# EAGLE schematic igep-lcd (EAGLE 6.2)
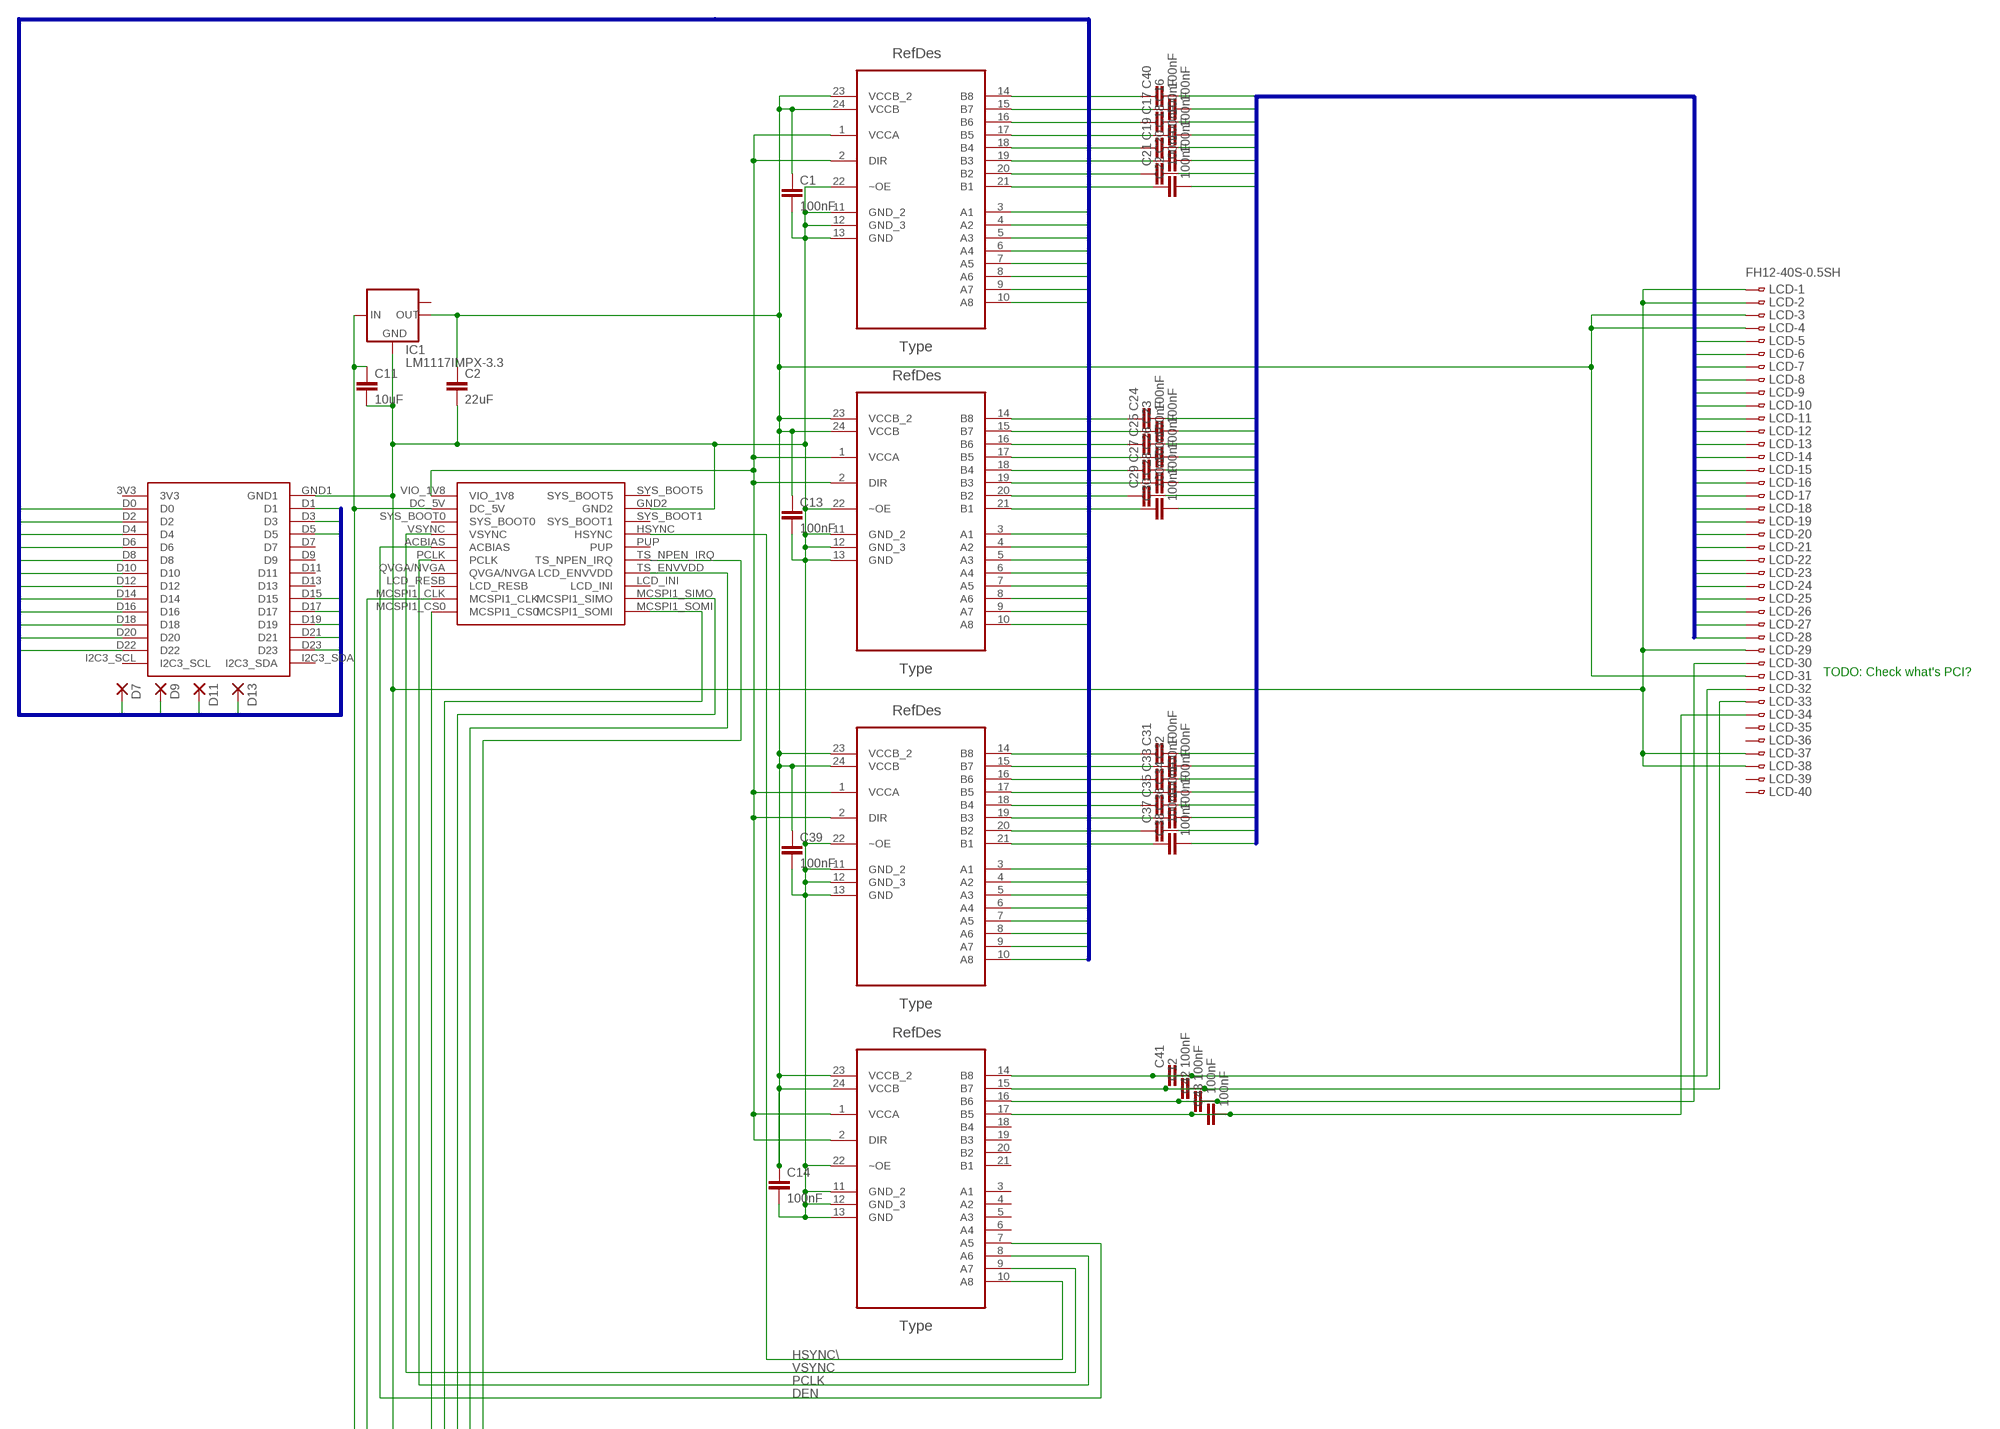
[diagram p0: schematic, sheet 1, part 1 of 2]
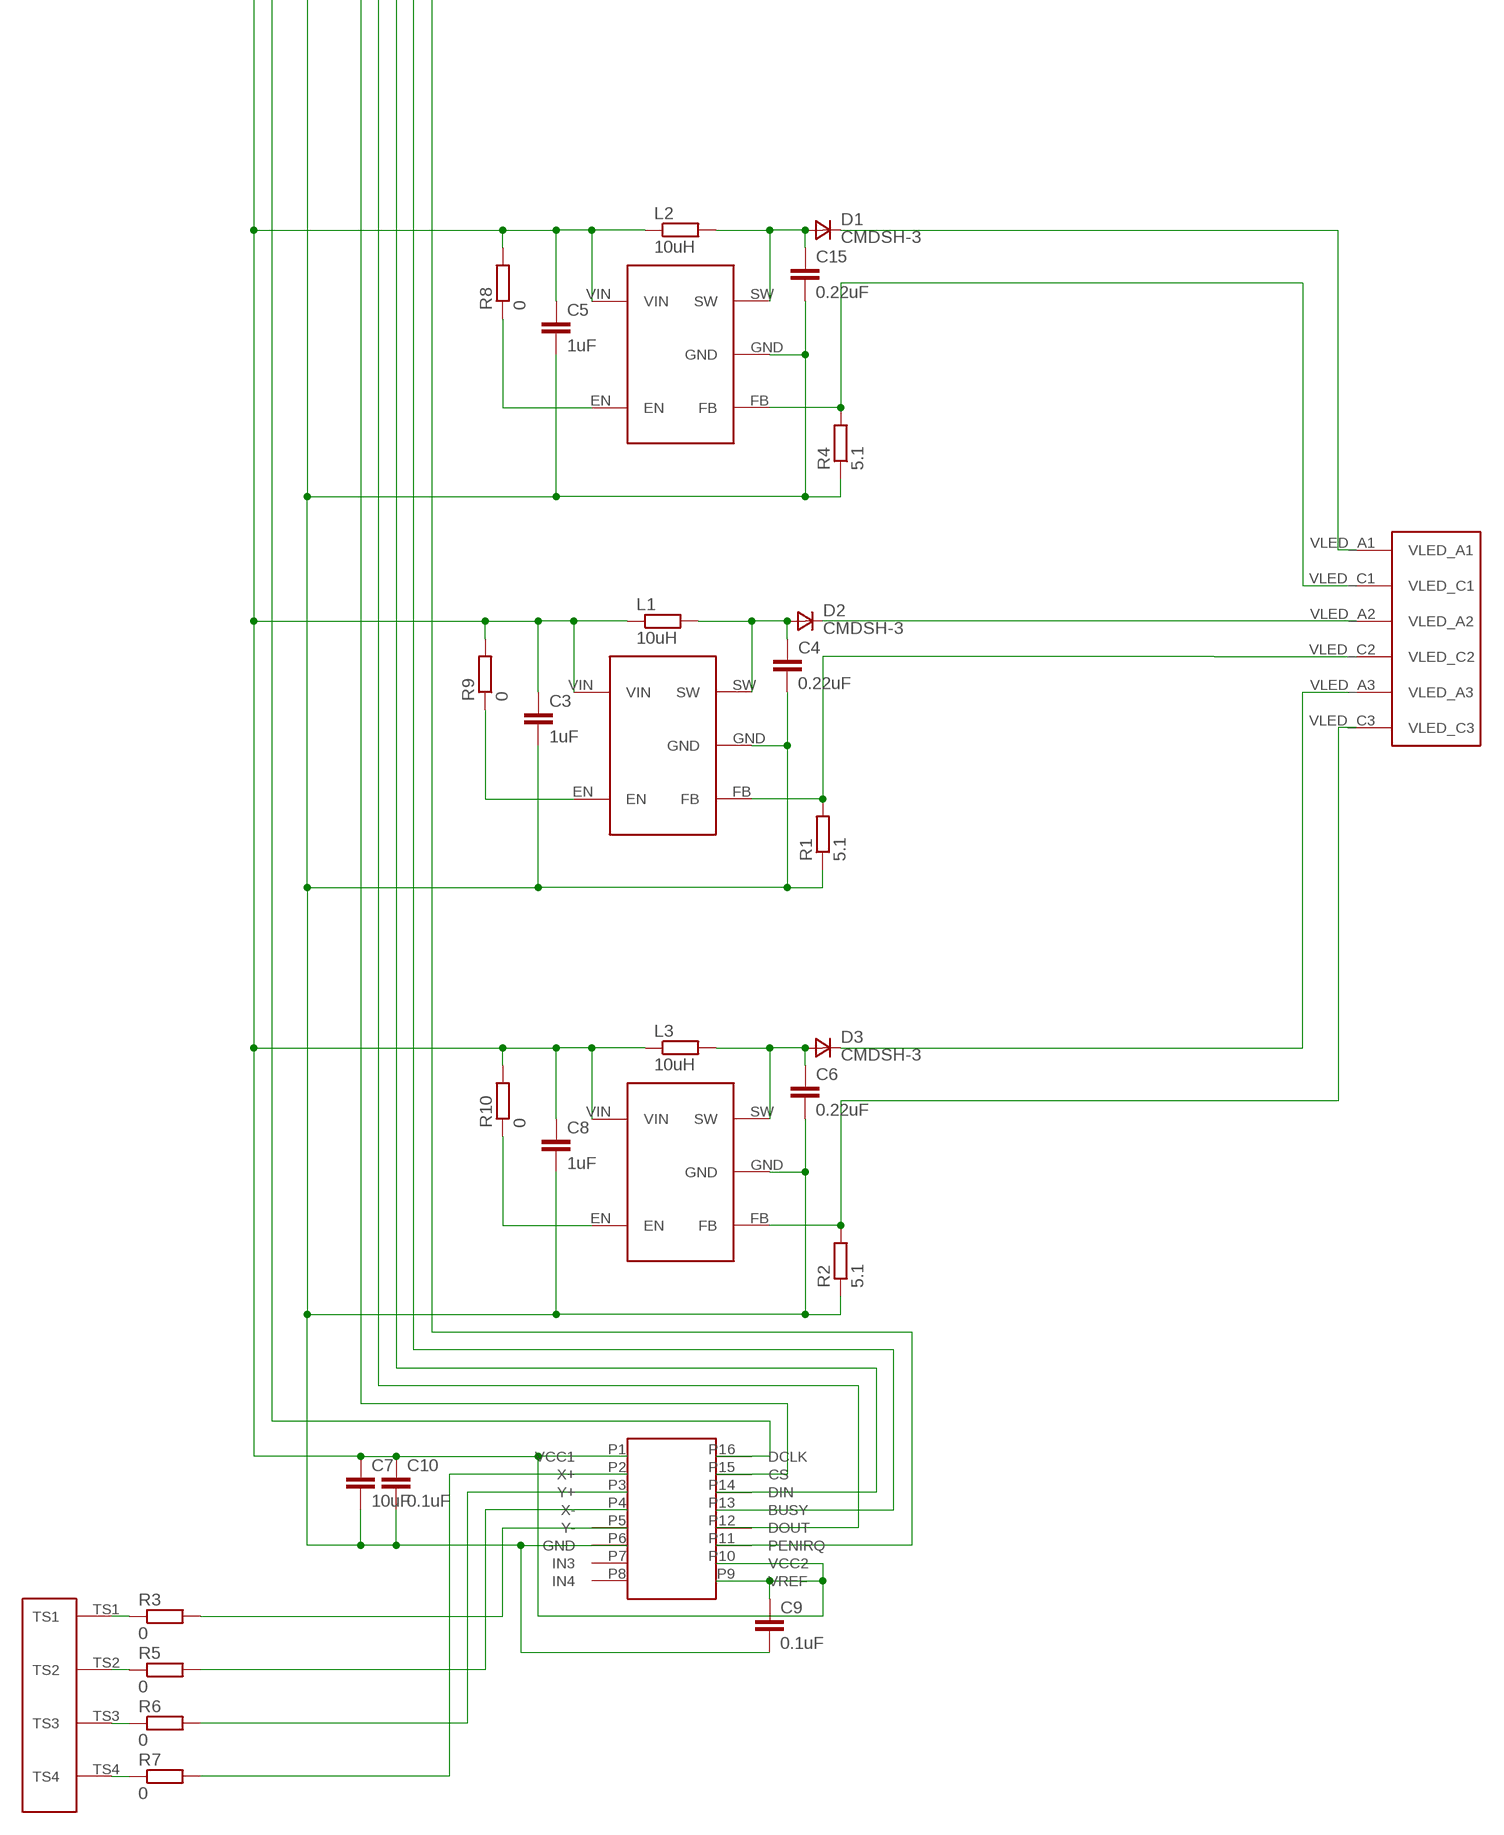
[diagram p1: schematic, sheet 1, part 2 of 2]

## Parts
C1  100nF  C-EUC1206  [C1206]
C2  22uF  C-EUC1206  [C1206]
C3  1uF  C-EUC1206  [C1206]
C4  0.22uF  C-EUC1206  [C1206]
C5  1uF  C-EUC1206  [C1206]
C6  0.22uF  C-EUC1206  [C1206]
C7  10uF  C-EUC1206  [C1206]
C8  1uF  C-EUC1206  [C1206]
C9  0.1uF  C-EUC1206  [C1206]
C10  0.1uF  C-EUC1206  [C1206]
C11  10uF  C-EUC1206  [C1206]
C12  100nF  C-EUC1206  [C1206]
C13  100nF  C-EUC1206  [C1206]
C14  100nF  C-EUC1206  [C1206]
C15  0.22uF  C-EUC1206  [C1206]
C16  100nF  C-EUC1206  [C1206]
C17  100nF  C-EUC1206  [C1206]
C18  100nF  C-EUC1206  [C1206]
C19  100nF  C-EUC1206  [C1206]
C20  100nF  C-EUC1206  [C1206]
C21  100nF  C-EUC1206  [C1206]
C22  100nF  C-EUC1206  [C1206]
C23  100nF  C-EUC1206  [C1206]
C24  100nF  C-EUC1206  [C1206]
C25  100nF  C-EUC1206  [C1206]
C26  100nF  C-EUC1206  [C1206]
C27  100nF  C-EUC1206  [C1206]
C28  100nF  C-EUC1206  [C1206]
C29  100nF  C-EUC1206  [C1206]
C30  100nF  C-EUC1206  [C1206]
C31  100nF  C-EUC1206  [C1206]
C32  100nF  C-EUC1206  [C1206]
C33  100nF  C-EUC1206  [C1206]
C34  100nF  C-EUC1206  [C1206]
C35  100nF  C-EUC1206  [C1206]
C36  100nF  C-EUC1206  [C1206]
C37  100nF  C-EUC1206  [C1206]
C38  100nF  C-EUC1206  [C1206]
C39  100nF  C-EUC1206  [C1206]
C40  100nF  C-EUC1206  [C1206]
C41  100nF  C-EUC1206  [C1206]
C42  100nF  C-EUC1206  [C1206]
C43  100nF  C-EUC1206  [C1206]
D1  CMDSH-3  DSOD323  [SOD323]
D2  CMDSH-3  DSOD323  [SOD323]
D3  CMDSH-3  DSOD323  [SOD323]
D7  1,6/0,8  [1,6/0,8]
D9  1,6/0,8  [1,6/0,8]
D11  1,6/0,8  [1,6/0,8]
D13  1,6/0,8  [1,6/0,8]
IC1  LM1117IMPX-3.3  [SOT223]
L1  10uH  R-EU_R1210  [R1210]
L2  10uH  R-EU_R1210  [R1210]
L3  10uH  R-EU_R1210  [R1210]
LCD  FH12-40S-0.5SH  [FH12-40S-0.5SH]
R1  5.1  R-EU_R1206  [R1206]
R2  5.1  R-EU_R1206  [R1206]
R3  0  R-EU_R1206  [R1206]
R4  5.1  R-EU_R1206  [R1206]
R5  0  R-EU_R1206  [R1206]
R6  0  R-EU_R1206  [R1206]
R7  0  R-EU_R1206  [R1206]
R8  0  R-EU_R1206  [R1206]
R9  0  R-EU_R1206  [R1206]
R10  0  R-EU_R1206  [R1206]
U1  SN74LVC8T245PW  [SOP65P640X120-24N]
U2  SN74LVC8T245PW  [SOP65P640X120-24N]
U3  SN74LVC8T245PW  [SOP65P640X120-24N]
U4  SN74LVC8T245PW  [SOP65P640X120-24N]
U$1  IGEP_LCD  [IGEP_LCD]
U$2  MIC2287  [MIC2287]
U$3  MIC2287  [MIC2287]
U$4  MIC2287  [MIC2287]
U$5  LCD_BL  [LCD_BL]
U$6  ADS7843  [ADS7843]
U$7  TS_CON  [TS_CON]

## Nets
DEN: U4.7(A5) U$1.ACBIAS
HSYNC\: U4.10(A8) U$1.HSYNC
IGEP_LCD_DATA0: U1.3(A1) U$1.D0
IGEP_LCD_DATA1: U1.4(A2) U$1.D1
IGEP_LCD_DATA2: U1.5(A3) U$1.D2
IGEP_LCD_DATA3: U1.6(A4) U$1.D3
IGEP_LCD_DATA4: U1.7(A5) U$1.D4
IGEP_LCD_DATA5: U1.8(A6) U$1.D5
IGEP_LCD_DATA6: U1.9(A7) U$1.D6
IGEP_LCD_DATA7: D7.1(P) U1.10(A8)
IGEP_LCD_DATA8: U2.3(A1) U$1.D8
IGEP_LCD_DATA9: D9.1(P) U2.4(A2)
IGEP_LCD_DATA10: U2.5(A3) U$1.D10
IGEP_LCD_DATA11: D11.1(P) U2.6(A4)
IGEP_LCD_DATA12: U2.7(A5) U$1.D12
IGEP_LCD_DATA13: D13.1(P) U2.8(A6)
IGEP_LCD_DATA14: U2.9(A7) U$1.D14
IGEP_LCD_DATA15: U2.10(A8) U$1.D15
IGEP_LCD_DATA16: U3.3(A1) U$1.D16
IGEP_LCD_DATA17: U3.4(A2) U$1.D17
IGEP_LCD_DATA18: U3.5(A3) U$1.D18
IGEP_LCD_DATA19: U3.6(A4) U$1.D19
IGEP_LCD_DATA20: U3.7(A5) U$1.D20
IGEP_LCD_DATA21: U3.8(A6) U$1.D21
IGEP_LCD_DATA22: U3.9(A7) U$1.D22
IGEP_LCD_DATA23: U3.10(A8) U$1.D23
LCD_DATA0: C22.2 LCD.21
LCD_DATA1: C21.2 LCD.22
LCD_DATA2: C20.2 LCD.23
LCD_DATA3: C19.2 LCD.24
LCD_DATA4: C18.2 LCD.25
LCD_DATA5: C17.2 LCD.26
LCD_DATA6: C16.2 LCD.27
LCD_DATA7: C40.2 LCD.28
LCD_DATA8: C30.2 LCD.13
LCD_DATA9: C29.2 LCD.14
LCD_DATA10: C28.2 LCD.15
LCD_DATA11: C27.2 LCD.16
LCD_DATA12: C26.2 LCD.17
LCD_DATA13: C25.2 LCD.18
LCD_DATA14: C23.2 LCD.19
LCD_DATA15: C24.2 LCD.20
LCD_DATA16: C38.2 LCD.5
LCD_DATA17: C37.2 LCD.6
LCD_DATA18: C36.2 LCD.7
LCD_DATA19: C35.2 LCD.8
LCD_DATA20: C34.2 LCD.9
LCD_DATA21: C33.2 LCD.10
LCD_DATA22: C32.2 LCD.11
LCD_DATA23: C31.2 LCD.12
N$1: U$1.MCSPI1_CLK U$6.P16(DCLK)
N$2: C1.2 C2.2 C3.2 C4.2 C5.2 C6.2 C7.2 C8.2 C9.2 C10.2 C11.2 C13.2 C14.2 C15.2 C39.2 IC1.1(GND) LCD.1 LCD.2 LCD.29 LCD.37 LCD.38 R1.1 R2.1 R4.1 U1.11(GND_2) U1.12(GND_3) U1.13(GND) U1.22(~OE) U2.11(GND_2) U2.12(GND_3) U2.13(GND) U2.22(~OE) U3.11(GND_2) U3.12(GND_3) U3.13(GND) U3.22(~OE) U4.11(GND_2) U4.12(GND_3) U4.13(GND) U4.22(~OE) U$1.GND1 U$1.GND2 U$2.GND U$3.GND U$4.GND U$6.P6(GND)
N$3: R7.1 U$7.TS4
N$4: U1.1(VCCA) U1.2(DIR) U2.1(VCCA) U2.2(DIR) U3.1(VCCA) U3.2(DIR) U4.1(VCCA) U4.2(DIR) U$1.VIO_1V8
N$5: C41.1 C41.2 LCD.32 U4.14(B8)
N$6: R6.1 U$7.TS3
N$7: U$1.MCSPI1_CS0 U$6.P15(CS)
N$8: C15.1 D1.2(A) L2.2 U$2.SW
N$9: C12.1 C12.2 LCD.33 U4.15(B7)
N$10: C42.1 C42.2 LCD.30 U4.16(B6)
N$11: C43.1 C43.2 LCD.34 U4.17(B5)
N$12: R5.1 U$7.TS2
N$13: D1.1(C) U$5.VLED_A1
N$14: R4.2 U$2.FB U$5.VLED_C1
N$15: C4.1 D2.2(A) L1.2 U$3.SW
N$16: D2.1(C) U$5.VLED_A2
N$17: R1.2 U$3.FB U$5.VLED_C2
N$18: R3.1 U$7.TS1
N$19: R10.1 U$4.EN
N$20: U$1.TS_NPEN_IRQ U$6.P11(PENIRQ)
N$21: C6.1 D3.2(A) L3.2 U$4.SW
N$22: D3.1(C) U$5.VLED_A3
N$23: R2.2 U$4.FB U$5.VLED_C3
N$24: R9.1 U$3.EN
N$25: U$1.TS_ENVVDD(LCD_ENVVDD) U$6.P13(BUSY)
N$26: U$1.MCSPI1_SIMO U$6.P14(DIN)
N$27: U$1.MCSPI1_SOMI U$6.P12(DOUT)
N$28: R8.1 U$2.EN
N$29: R3.2 U$6.P5(Y-)
N$30: C38.1 U3.21(B1)
N$31: R5.2 U$6.P4(X-)
N$32: C37.1 U3.20(B2)
N$33: R6.2 U$6.P3(Y+)
N$34: R7.2 U$6.P2(X+)
N$35: C3.1 C5.1 C7.1 C8.1 C9.1 C10.1 C11.1 IC1.3(IN) L1.1 L2.1 L3.1 R8.2 R9.2 R10.2 U$1.DC_5V U$2.VIN U$3.VIN U$4.VIN U$6.P1(VCC1) U$6.P9(VREF) U$6.P10(VCC2)
N$36: C1.1 C2.1 C13.1 C14.1 C39.1 IC1.2(OUT) LCD.3 LCD.4 LCD.31 U1.23(VCCB_2) U1.24(VCCB) U2.23(VCCB_2) U2.24(VCCB) U3.23(VCCB_2) U3.24(VCCB) U4.23(VCCB_2) U4.24(VCCB)
N$37: C36.1 U3.19(B3)
N$38: C35.1 U3.18(B4)
N$39: C34.1 U3.17(B5)
N$40: C33.1 U3.16(B6)
N$41: C32.1 U3.15(B7)
N$42: C31.1 U3.14(B8)
N$43: C30.1 U2.21(B1)
N$44: C29.1 U2.20(B2)
N$45: C28.1 U2.19(B3)
N$46: C27.1 U2.18(B4)
N$47: C26.1 U2.17(B5)
N$48: C25.1 U2.16(B6)
N$49: C23.1 U2.15(B7)
N$50: C24.1 U2.14(B8)
N$51: C22.1 U1.21(B1)
N$52: C21.1 U1.20(B2)
N$53: C20.1 U1.19(B3)
N$54: C19.1 U1.18(B4)
N$55: C18.1 U1.17(B5)
N$56: C17.1 U1.16(B6)
N$57: C16.1 U1.15(B7)
N$58: C40.1 U1.14(B8)
PCLK: U4.8(A6) U$1.PCLK
VSYNC: U4.9(A7) U$1.VSYNC
Unconnected: IC1.TAB(OUT1) LCD.35 LCD.36 LCD.39 LCD.40 U4.3(A1) U4.4(A2) U4.5(A3) U4.6(A4) U4.18(B4) U4.19(B3) U4.20(B2) U4.21(B1) U$1.3V3 U$1.D7 U$1.D9 U$1.D11 U$1.D13 U$1.I2C3_SCL U$1.I2C3_SDA U$1.LCD_INI U$1.LCD_RESB U$1.PUP U$1.QVGA/NVGA U$1.SYS_BOOT0 U$1.SYS_BOOT1 U$1.SYS_BOOT5 U$6.P7(IN3) U$6.P8(IN4)

## Buses
IGEP_LCD_DATA[0..23]
LCD_DATA[0..23]

## Notes on the sheet
- TODO: Check what's PCI?

## Library data of the parts
C1-C43 = rcl:C-EU: CAPACITOR, European symbol
D1-D3 = zetex:D: DIODE; MPN: CDSOD323-T05C; OC_FARNELL: 1824860; OC_NEWARK: 79R6078
D7 D9 D11 D13 = wirepad:1,6/0,8: THROUGH-HOLE PAD
IC1 = lm1117:LM1117IMPX-*
L1-L3 = resistor:R-EU_: RESISTOR, European symbol
LCD = con-hirose:FH12-40S-0.5S: 0.5mm Pitch Connectors For FPC/FFC Source: Data sheet <http://www.hirose.co.jp/cataloge_hp/e58605370.pdf>; MPN: FH12-40S-0.5SH(55); OC_FARNELL: 1324556; OC_NEWARK: 34M6178
R1-R10 = rcl:R-EU_: RESISTOR, European symbol
U1-U4 = TI-SN74LVC8T245PW:SN74LVC8T245PW; DESCRIPTION: 8-BIT DUAL-SUPPLY BUS TRANSCEIVER WITH CONFIGURABLE VOLTAGE TRANSLATION AND 3-STATE OUTPUTS; MPN: SN74LVC8T245PW; OC_FARNELL: 1236407; OC_NEWARK: 58K6537; PACKAGE: TSSOP-24; SUPPLIER: Texas Instruments
U$1 = igep-lcd:IGEP_LCD
U$2-U$4 = mic2287:MIC2287
U$5 = lcd-bl:LCD_BL
U$6 = ads7843:ADS7843
U$7 = ts_con:TS_CON